# Altium schematic sheet Outputs.SchDoc: Isolated Output
size A4; Revision: 1; SheetNumber: 4; SheetTotal: 7; SheetSize: A4
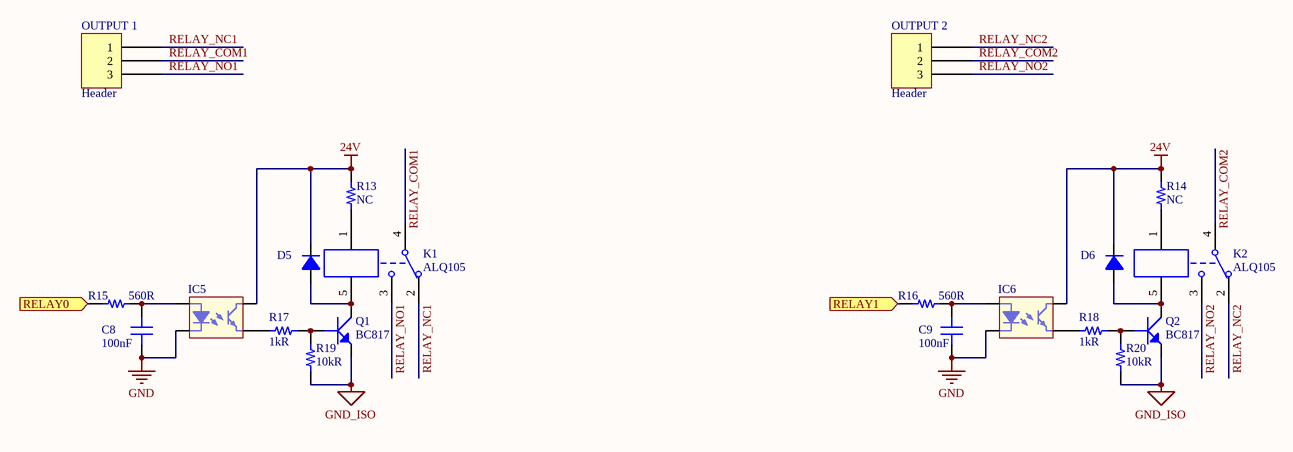
[diagram p0: Outputs.SchDoc]

## Parts
C8  100nF  [CAP 0603/1608]
C9  100nF  [CAP 0603/1608]
D5  1N4148WTR  [sod123]  (value not drawn)
D6  1N4148WTR  [sod123]  (value not drawn)
IC5  EL3H7(B)(TA)-VG  [EL3H7-VG]  (value not drawn)
IC6  EL3H7(B)(TA)-VG  [EL3H7-VG]  (value not drawn)
K1  ALQ105  [ALQ105]
K2  ALQ105  [ALQ105]
OUTPUT_1  Header  [TE 282834-3]
OUTPUT_2  Header  [TE 282834-3]
Q1  BC817  [SOT23-3]  (no BOM)
Q2  BC817  [SOT23-3]  (no BOM)
R13  NC  [RES 0603/1608]  (no BOM)
R14  NC  [RES 0603/1608]  (no BOM)
R15  560R  [RES 0603/1608]
R16  560R  [RES 0603/1608]
R17  1kR  [RES 0603/1608]
R18  1kR  [RES 0603/1608]
R19  10kR  [RES 0603/1608]
R20  10kR  [RES 0603/1608]

## Ports
RELAY0 (in), RELAY1 (in)

## Nets
24V: D5.2 D6.2 IC5.4 IC6.4 R13.2 R14.2
GND: C8.1 C9.1 IC5.2 IC6.2
GND_ISO: Q1.2(E) Q2.2(E) R19.2 R20.2
RELAY0: R15.1 ; port RELAY0
RELAY1: R16.1 ; port RELAY1
RELAY_COM1: K1.4(COM) OUTPUT_1.2
RELAY_COM2: K2.4(COM) OUTPUT_2.2
RELAY_NC1: K1.2(NC) OUTPUT_1.1
RELAY_NC2: K2.2(NC) OUTPUT_2.1
RELAY_NO1: K1.3(NO) OUTPUT_1.3
RELAY_NO2: K2.3(NO) OUTPUT_2.3
NetC8_2: C8.2 IC5.1 R15.2
NetC9_2: C9.2 IC6.1 R16.2
NetD5_1: D5.1 K1.5(COIL) Q1.3(C)
NetD6_1: D6.1 K2.5(COIL) Q2.3(C)
NetIC5_3: IC5.3 R17.2
NetIC6_3: IC6.3 R18.2
NetK1_1: K1.1(COIL) R13.1
NetK2_1: K2.1(COIL) R14.1
NetQ1_1: Q1.1(B) R17.1 R19.1
NetQ2_1: Q2.1(B) R18.1 R20.1

## Notes on the sheet
- Title:
- Size:
- Project:
- Revision:
- Sheet
- of
- Date:
- YıLDıZ IoT
- Elperek Mahallesi
- Saray Sokak, No:12
- SAKARYA / TURKEY
- File:

## Library data of the parts
C8 C9 = Capacitor - Ceramic: Ceramic, SMT Capacitor; Manufacturer: Samsung; Manufacturer Part Number: CL10B104JB8NNNC; Tolerance: 5%; Voltage Rating: 50V; Dielectric: X7R; Supplier 1: Digi-Key; Supplier Part Number 1: 1276-1033-1-ND; Stock 1: 223594; Pricing 1: 1 = 0,10000, 10 = 0,05300, 100 = 0,02350, 500 = 0,01680, 1000 = 0,01320 (USD); RoHS: Yes; Mount: Surface Mount; Case/Package: 0603; Case Code (Metric): 1608; Case Code (Imperial): 0603; Material: Ceramic; Contact Plating: Tin; Min Operating Temperature: -55°C; Max Operating Temperature: 125°C; Packaging: Tape and Reel; Package Quantity: 1; Capacitance: 100nF; Voltage: 50V; Length: 1.6mm; Height: 0.8mm; Width: 0.031inch; Thickness: 0.035inch; Depth: 0.8mm; Radiation Hardening: No; ComponentLink1URL: https://media.digikey.com/pdf/Data%20Sheets/Samsung%20PDFs/CL_Series_MLCC_ds.pdf?src-supplier=Digi-Key; ComponentLink1Description: https://media.digikey.com/pdf/Data%20Sheets/Samsung%20PDFs/CL_Series_MLCC_ds.pdf?src-supplier=Digi-Key; ComponentLink2URL: https://www.verical.com/server-webapp/html/getDatasheet?partID=359321&src-supplier=Verical; ComponentLink2Description: https://www.verical.com/server-webapp/html/getDatasheet?partID=359321&src-supplier=Verical; ComponentLink3URL: http://www1.futureelectronics.com/doc/SAMSUNG/CL10B104JB8NNNC.pdf?src-supplier=Future+Electronics; ComponentLink3Description: http://www1.futureelectronics.com/doc/SAMSUNG/CL10B104JB8NNNC.pdf?src-supplier=Future+Electronics; ComponentLink4URL: https://produktinfo.conrad.com/datenblaetter/450000-474999/456613-da-01-en-VS_KONDENSATOR_0603.pdf?src-supplier=Conrad; ComponentLink4Description: https://produktinfo.conrad.com/datenblaetter/450000-474999/456613-da-01-en-VS_KONDENSATOR_0603.pdf?src-supplier=Conrad
D5 D6 = Diode: Manufacturer: SMC; Max Reverse Voltage (DC): 75V; Average Rectified Current: 250mA; Reverse Recovery Time: 4ns; ComponentLink1URL: http://www.smc-diodes.com/propdf/1N4148W%20N0571%20REV.D.pdf?src-supplier=Digi-Key; ComponentLink1Description: http://www.smc-diodes.com/propdf/1N4148W%20N0571%20REV.D.pdf?src-supplier=Digi-Key; Supplier 1: Digi-Key; Supplier Part Number 1: 1655-1360-1-ND; Manufacturer Part Number: 1N4148WTR; Stock 1: 8882; Pricing 1: 1 = 0,12000, 10 = 0,11300, 25 = 0,10720, 100 = 0,04710, 250 = 0,04524, 500 = 0,03702, 1000 = 0,02571 (USD); RoHS: No; Mount: Surface Mount; Packaging: Tape and Reel
IC5 IC6 = Optoisolator: Manufacturer: Everlight; Number of Channels: 1; Collector Emitter Voltage (VCEO): 80V; Max Power Dissipation: 200mW; Forward Current: 50mA; Forward Voltage: 1.4V; Reverse Breakdown Voltage: 6V; Rise Time: 18000ns; Collector Emitter Saturation Voltage: 200mV; Isolation Voltage: 3.75kV; Current Transfer Ratio: 260%; Approvals: UL; Supplier 1: Digi-Key; Supplier Part Number 1: 1080-1197-1-ND; Manufacturer Part Number: EL3H7(B)(TA)-VG; Stock 1: 29823; Pricing 1: 1 = 0,50000, 10 = 0,35500, 100 = 0,20730, 500 = 0,14212, 1000 = 0,11844, 2500 = 0,10660 (USD); RoHS: Yes; Mount: Surface Mount; Case/Package: SSOP; Number of Pins: 4; Min Operating Temperature: -55°C; Max Operating Temperature: 125°C; Packaging: Tape and Reel; Package Quantity: 1; Max Output Voltage: 80V; Output Current per Channel: 50mA; Max Input Current: 50mA; Max Collector Current: 50mA; Fall Time: 18000ns; Number of Elements: 1; Power Dissipation: 200mW; Collector Emitter Breakdown Voltage: 80V; Radiation Hardening: No; Lead Free: Lead Free; ComponentLink1URL: https://datasheet.ciiva.com/2086/el3h7-g-series-2086501.pdf?src-supplier=Digi-Key; ComponentLink1Description: https://datasheet.ciiva.com/2086/el3h7-g-series-2086501.pdf?src-supplier=Digi-Key; ComponentLink2URL: https://datasheet.ciiva.com/2086/el3h7-g-series-2086502.pdf?src-supplier=Digi-Key; ComponentLink2Description: https://datasheet.ciiva.com/2086/el3h7-g-series-2086502.pdf?src-supplier=Digi-Key; ComponentLink3URL: https://datasheet.ciiva.com/2086/el3h7-g-series-2086503.pdf?src-supplier=Digi-Key; ComponentLink3Description: https://datasheet.ciiva.com/2086/el3h7-g-series-2086503.pdf?src-supplier=Digi-Key; ComponentLink4URL: https://datasheet.ciiva.com/15209/getdatasheetpartid-416716-15209115.pdf?src-supplier=Verical; ComponentLink4Description: https://datasheet.ciiva.com/15209/getdatasheetpartid-416716-15209115.pdf?src-supplier=Verical
K1 K2 = Relay SPDT: Relay or Contactor; Manufacturer: Panasonic; Coil Voltage (DC): 5V; Coil Type: Non-Latching; Relay Type: General Purpose; Throw Configuration: SPDT; Coil Resistance: 62.5R; Coil Current: 80mA; Operate Time: 20ms; Coil Power: 400mW; Max Voltage Rating (AC): 250V; Contact Current Rating: 10A; Supplier 1: Digi-Key; Supplier Part Number 1: 255-3565-ND; Manufacturer Part Number: ALQ105; Stock 1: 8117; Pricing 1: 1 = 1,22000, 10 = 1,14800, 25 = 1,02000, 50 = 0,96900, 100 = 0,91800, 250 = 0,81600, 500 = 0,76500, 1000 = 0,71400, 5000 = 0,68850 (USD); RoHS: Yes; Number of Pins: 5; Weight: 7g; Contact Material: Silver; Min Operating Temperature: -40°C; Max Operating Temperature: 85°C; Termination: PC Pin; Release Time: 20ms; Package Quantity: 100; Packaging: Carton; Power Rating: 400mW; Power Consumption: 400mW; Voltage Rating (AC): 250V; Length: 20mm; Height: 16mm; Depth: 10mm; Width: 10mm; Lead Free: Lead Free; REACH SVHC: Unknown; ComponentLink1URL: http://www.mouser.com/ds/2/315/lq-catalog-1075796.pdf?src-supplier=Mouser; ComponentLink1Description: http://www.mouser.com/ds/2/315/lq-catalog-1075796.pdf?src-supplier=Mouser; ComponentLink2URL: http://www.farnell.com/datasheets/2245159.pdf?src-supplier=Farnell; ComponentLink2Description: http://www.farnell.com/datasheets/2245159.pdf?src-supplier=Farnell; ComponentLink3URL: http://components.arrow.com/part/dataview/0323_06571492?src-supplier=Arrow+Europe; ComponentLink3Description: http://components.arrow.com/part/dataview/0323_06571492?src-supplier=Arrow+Europe; ComponentLink4URL: http://www.alliedelec.com/m/d/b3e6213128df2023f710f2e9cac83292.pdf?src-supplier=Allied+Electronics; ComponentLink4Description: http://www.alliedelec.com/m/d/b3e6213128df2023f710f2e9cac83292.pdf?src-supplier=Allied+Electronics; ComponentLink5URL: https://media.digikey.com/pdf/Data%20Sheets/Panasonic%20Electric%20Works%20PDFs/ALQ(LQ)Relays_NewProdIntro.pdf?src-supplier=Digi-Key; ComponentLink5Description: https://media.digikey.com/pdf/Data%20Sheets/Panasonic%20Electric%20Works%20PDFs/ALQ(LQ)Relays_NewProdIntro.pdf?src-supplier=Digi-Key; ComponentLink6URL: http://www.farnell.com/datasheets/1972641.pdf?src-supplier=Element14; ComponentLink6Description: http://www.farnell.com/datasheets/1972641.pdf?src-supplier=Element14; ComponentLink7URL: http://www.farnell.com/datasheets/2245159.pdf?src-supplier=Newark; ComponentLink7Description: http://www.farnell.com/datasheets/2245159.pdf?src-supplier=Newark
OUTPUT_1 OUTPUT_2 = 3 Pin: Manufacturer: On-Shore Technology; Manufacturer Part Number: OSTVN03A150; Plating: Brass,Steel; Number of Levels: 1; Number of Positions Per Level: 3; Current: 6A; Voltage: 125V; Pitch: 0.1inch; Wire Gauge (Max): 30AWG; Wire Gauge (Min): 20AWG; Supplier 1: Digi-Key; Supplier Part Number 1: ED10562-ND; Stock 1: 6258; Pricing 1: 1 = 1,03000, 10 = 0,72600, 25 = 0,67720, 50 = 0,61480, 100 = 0,61200, 250 = 0,51680, 500 = 0,48960, 1000 = 0,43520, 5000 = 0,35360 (USD); RoHS: Yes; Mount: Through Hole; Number of Pins: 3; Housing Material: Thermoplastic; Color: Green; Contact Plating: Brass; Min Operating Temperature: -30°C; Max Operating Temperature: 105°C; Termination: Screw; Packaging: Bulk; ComponentLink1URL: https://datasheet.ciiva.com/825/ostvnxxa150-825196.pdf?src-supplier=Digi-Key; ComponentLink1Description: https://datasheet.ciiva.com/825/ostvnxxa150-825196.pdf?src-supplier=Digi-Key
Q1 Q2 = BC817: Transistor, BC817; Manufacturer: ON Semiconductor; Manufacturer Part Number: BC817-16LT1G; Transistor Type: NPN; Vce Saturation (Max) @ Ib, Ic: 700mV @ 50mA, 500mA; Current - Collector Cutoff (Max): 100nA (ICBO); DC Current Gain (hFE) (Min) @ Ic, Vce: 100 @ 100mA, 1V; Frequency - Transition: 100MHz; Supplier 1: Digi-Key; Supplier Part Number 1: BC817-16LT1GOSCT-ND; RoHS: RoHS Compliant; Category: Discrete Semiconductor Products; Stock 1: 46603; Pricing 1: 1=0.13, 10=0.118, 100=0.0642, 500=0.0395, 1000=0.02693 (USD); Packaging: Cut Tape (CT); Part Status: Active; Operating Temperature: -65°C ~ 150°C (TJ); Mounting Type: Surface Mount; Package / Case: TO-236-3, SC-59, SOT-23-3; Supplier Device Package: SOT-23-3 (TO-236); Base Part Number: BC817; ComponentLink1URL: http://www.onsemi.com/pub/Collateral/BC817-16LT1-D.PDF; ComponentLink1Description: http://www.onsemi.com/pub/Collateral/BC817-16LT1-D.PDF; Price: 0,13
R13 R14 = Resistor_Chip: Ceramic, SMT Capacitor; Resistance: NC
R15 R16 = Resistor_Chip: Ceramic, SMT Capacitor; Manufacturer: Rohm; Manufacturer Part Number: ESR03EZPJ561; Tolerance: 5%; Temperature Coefficient: 200ppm/°C; Max Power Dissipation: 250mW; Supplier 1: Digi-Key; Supplier Part Number 1: RHM560DCT-ND; Stock 1: 14494; Pricing 1: 1 = 0,10000, 10 = 0,08700, 100 = 0,03330, 1000 = 0,01464, 2500 = 0,01264 (USD); RoHS: Yes; Case/Package: 0603; Case Code (Metric): 1608; Case Code (Imperial): 0603; Min Operating Temperature: -55°C; Max Operating Temperature: 155°C; Package Quantity: 1; Resistance: 560R; Packaging: Tape and Reel; Composition: Thick Film; Number of Terminations: 2; Features: Automotive AEC-Q200; Length: 0.063inch; Height: 0.022inch; Width: 0.031inch; ComponentLink1URL: http://www.rohm.com/web/global/datasheet/ESR01MZPF/esr-e; ComponentLink1Description: http://www.rohm.com/web/global/datasheet/ESR01MZPF/esr-e; ComponentLink2URL: https://www.rohm.com/datasheet/ESR01MZPF/esr-e; ComponentLink2Description: https://www.rohm.com/datasheet/ESR01MZPF/esr-e
R17 R18 = Resistor_Chip: Ceramic, SMT Capacitor; Manufacturer: Rohm; Manufacturer Part Number: ESR03EZPJ102; Tolerance: 5%; Temperature Coefficient: 200ppm/°C; Max Power Dissipation: 250mW; Supplier 1: Digi-Key; Supplier Part Number 1: RHM1.0KDCT-ND; Stock 1: 148117; Pricing 1: 1 = 0,10000, 10 = 0,08300, 100 = 0,03180, 1000 = 0,01398, 2500 = 0,01207 (USD); RoHS: Yes; Case/Package: 0603; Case Code (Metric): 1608; Case Code (Imperial): 0603; Min Operating Temperature: -55°C; Max Operating Temperature: 155°C; Resistance: 1kR; Package Quantity: 1; Packaging: Tape and Reel; Composition: Thick Film; Number of Terminations: 2; Features: Automotive AEC-Q200; Length: 0.063inch; Height: 0.022inch; Width: 0.031inch; Lead Free: Lead Free; ComponentLink1URL: https://datasheet.ciiva.com/2469/esr-2469603.pdf?src-supplier=Digi-Key; ComponentLink1Description: https://datasheet.ciiva.com/2469/esr-2469603.pdf?src-supplier=Digi-Key; ComponentLink2URL: https://datasheet.ciiva.com/2469/esr-2469604.pdf?src-supplier=Digi-Key; ComponentLink2Description: https://datasheet.ciiva.com/2469/esr-2469604.pdf?src-supplier=Digi-Key; ComponentLink3URL: https://datasheet.ciiva.com/2469/esr-2469605.pdf?src-supplier=Digi-Key; ComponentLink3Description: https://datasheet.ciiva.com/2469/esr-2469605.pdf?src-supplier=Digi-Key
R19 R20 = Resistor_Chip: Ceramic, SMT Capacitor; Manufacturer: Stackpole Electronics; Manufacturer Part Number: RNCP0603FTD10K0; Tolerance: 1%; Max Power Dissipation: 125mW; Temperature Coefficient: 100ppm/°C; Supplier 1: Digi-Key; Supplier Part Number 1: RNCP0603FTD10K0CT-ND; Stock 1: 183083; Pricing 1: 1 = 0,10000, 10 = 0,06700, 100 = 0,02730, 1000 = 0,01224, 2500 = 0,01063 (USD); RoHS: Yes; Mount: Surface Mount; Case/Package: 0603; Case Code (Metric): 1608; Case Code (Imperial): 0603; Contact Plating: Matte,Tin; Min Operating Temperature: -55°C; Max Operating Temperature: 155°C; Packaging: Tape and Reel; Resistance: 10kR; Composition: Thin Film; Number of Terminations: 2; Features: Anti-Sulfur,Moisture Resistant; Length: 0.059inch; Height: 0.02inch; Width: 0.031inch; Radiation Hardening: No; Lead Free: Lead Free